# Altium schematic sheet IOT_Sheet.SchDoc
size A4; SheetNumber: 1; SheetTotal: 1
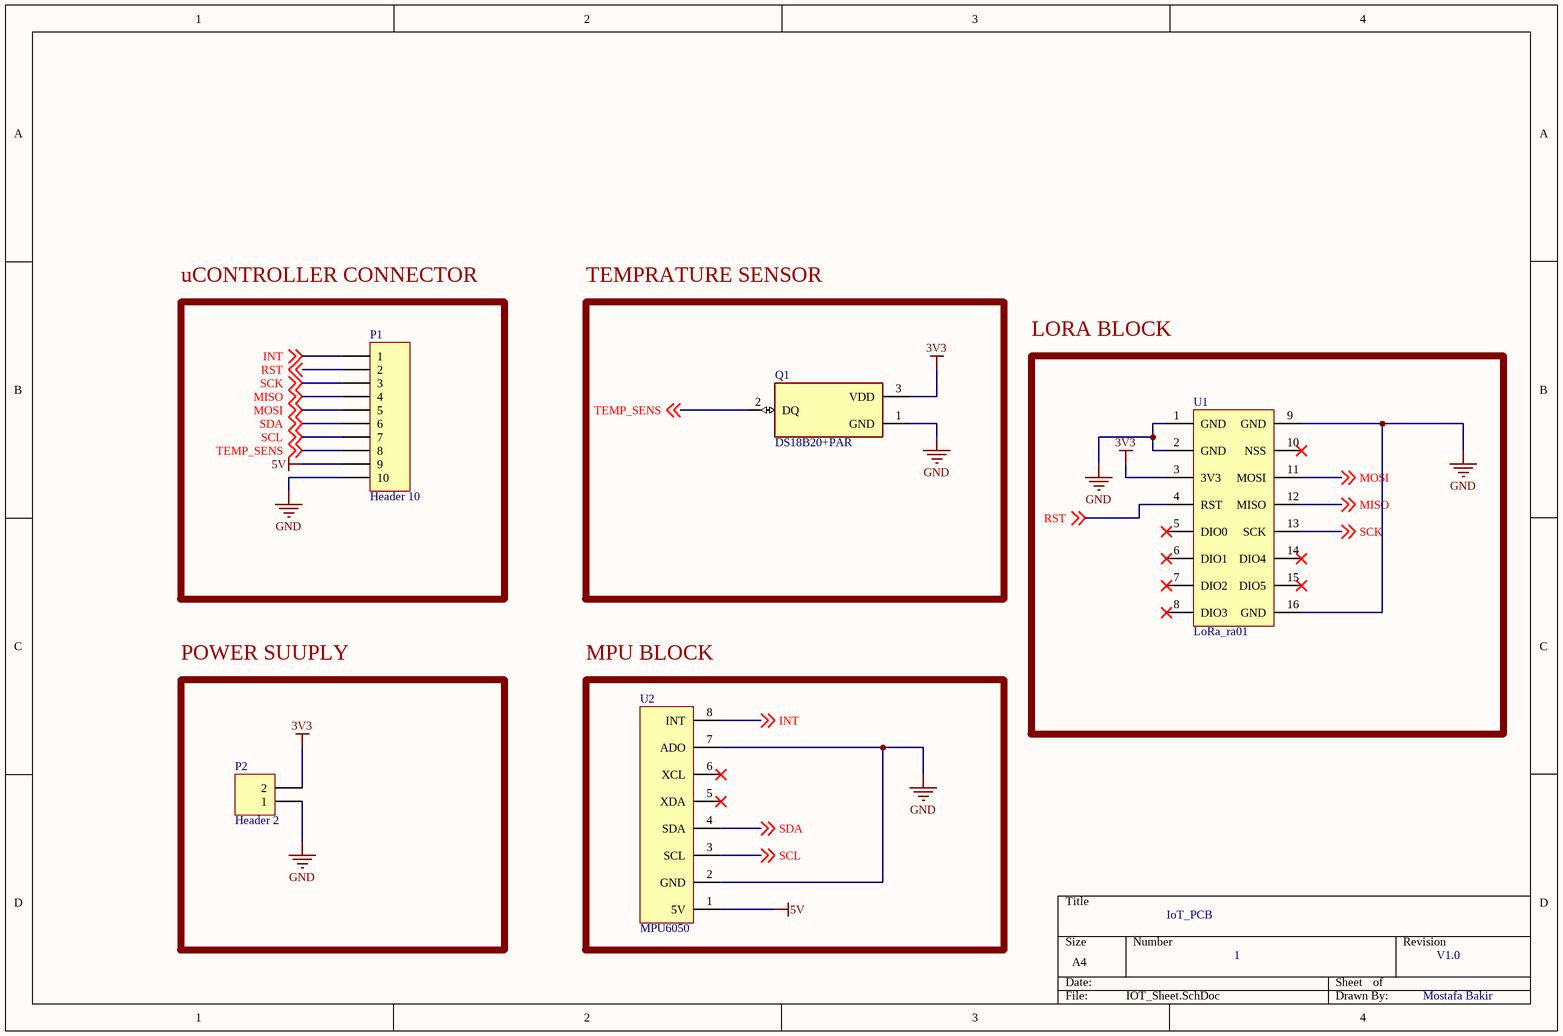
[diagram p0: IOT_Sheet.SchDoc]

## Parts
P1  Header 10  [HDR1X10]
P2  Header 2  [HDR1X2]
Q1  DS18B20+PAR  [TO-92]
U1  LoRa_ra01  [LoRa_pcblib]
U2  MPU6050  [MPU6050]

## Blocks framed on the sheet
uCONTROLLER CONNECTOR: P1
TEMPRATURE SENSOR: Q1
LORA BLOCK: U1
POWER SUUPLY: P2
MPU BLOCK: U2

## Nets
3V3: P2.2 Q1.3(VDD) U1.3(3V3)
5V: P1.9 U2.1(5V)
GND: P1.10 P2.1 Q1.1(GND) U1.1(GND) U1.2(GND) U1.9(GND) U1.16(GND) U2.2(GND) U2.7(ADO)
INT: P1.1 U2.8(INT) ; off-sheet INT
MISO: P1.4 U1.12(MISO) ; off-sheet MISO
MOSI: P1.5 U1.11(MOSI) ; off-sheet MOSI
RST: P1.2 U1.4(RST) ; off-sheet RST
SCK: P1.3 U1.13(SCK) ; off-sheet SCK
SCL: P1.7 U2.3(SCL) ; off-sheet SCL
SDA: P1.6 U2.4(SDA) ; off-sheet SDA
TEMP_SENS: P1.8 Q1.2(DQ) ; off-sheet TEMP_SENS

Not connected (* = marked no-connect by the designer): U1 5(DIO0)* 6(DIO1)* 7(DIO2)* 8(DIO3)* 10(NSS)* 14(DIO4)* 15(DIO5)*; U2 5(XDA)* 6(XCL)*

## Notes on the sheet
- IoT_PCB
- 1
- V1.0
- Mostafa Bakir

## Library data of the parts
P1 = Header 10: Header, 10-Pin; LatestRevisionDate: 17-Jul-2002; LatestRevisionNote: Re-released for DXP Platform.; Publisher: Altium Limited
P2 = Header 2: Header, 2-Pin; LatestRevisionDate: 17-Jul-2002; LatestRevisionNote: Re-released for DXP Platform.; Publisher: Altium Limited
Q1 = DS18B20+PAR: Temperature Sensor Digital, Local -55Â°C ~ 125Â°C 12 b TO-92-3; MF: Maxim Integrated; Value: *; Purchase-URL: https://pricing.snapeda.com/search/part/DS18B20+PAR/?ref=eda; Package: TO92-3 Maxim; Check_prices: https://www.snapeda.com/parts/DS18B20+PAR/Maxim%20Integrated/view-part/104007/?ref=eda; SnapEDA_Link: https://www.snapeda.com/parts/DS18B20+PAR/Maxim%20Integrated/view-part/104007/?ref=snap; Price: None; Availability: Warning; MP: DS18B20+PAR
U1 = Lora module sx1278
U2 = MPU6050: ComponentLink1Description: MAKERS; ComponentLink1URL: https://makerselectronics.com/product/imu-mpu-6050-gyroscope-accelerometer-sensor-module